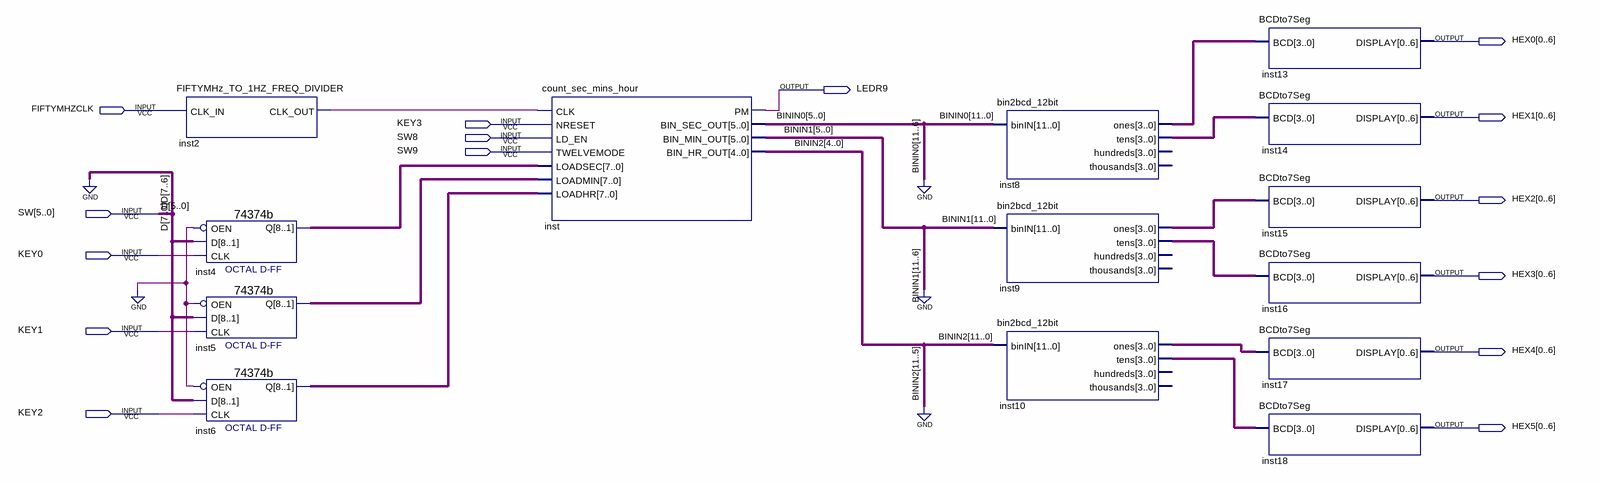
[diagram p0: schematic sheet]
// Quartus schematic lab3redo.bdf as structural Verilog: 14 symbols, 15 pins
module lab3redo (
  input  FIFTYMHZCLK,
  input  KEY3,
  input  SW8,
  input  SW9,
  input  [5:0] SW,
  input  KEY0,
  input  KEY1,
  input  KEY2,
  output [0:6] HEX0,
  output LEDR9,
  output [0:6] HEX1,
  output [0:6] HEX2,
  output [0:6] HEX3,
  output [0:6] HEX4,
  output [0:6] HEX5
);

  wire inst2_clk_out;
  wire [3:0] inst8_ones, inst8_tens, inst9_ones, inst9_tens, inst10_ones, inst10_tens;
  wire [4:0] BININ2;
  wire [5:0] BININ0, BININ1;
  wire [7:0] inst4_q, inst5_q, inst6_q;

  FIFTYMHz_TO_1HZ_FREQ_DIVIDER inst2 (.CLK_IN(FIFTYMHZCLK), .CLK_OUT(inst2_clk_out));
  \74374b  inst4 (.D({2'b00, SW}), .OEN(1'b0), .CLK(KEY0), .Q(inst4_q));
  \74374b  inst5 (.D({2'b00, SW}), .OEN(1'b0), .CLK(KEY1), .Q(inst5_q));
  \74374b  inst6 (.D({2'b00, SW}), .OEN(1'b0), .CLK(KEY2), .Q(inst6_q));
  count_sec_mins_hour inst (
    .CLK(inst2_clk_out), .NRESET(KEY3), .LD_EN(SW8), .TWELVEMODE(SW9), .LOADSEC(inst4_q), .LOADMIN(inst5_q),
    .LOADHR(inst6_q), .PM(LEDR9), .BIN_SEC_OUT(BININ0), .BIN_MIN_OUT(BININ1), .BIN_HR_OUT(BININ2));
  bin2bcd_12bit inst8 (.binIN({{6{1'b0}}, BININ0}), .ones(inst8_ones), .tens(inst8_tens));  // open: hundreds, thousands
  bin2bcd_12bit inst9 (.binIN({{6{1'b0}}, BININ1}), .ones(inst9_ones), .tens(inst9_tens));  // open: hundreds, thousands
  bin2bcd_12bit inst10 (
    .binIN({{7{1'b0}}, BININ2}), .ones(inst10_ones), .tens(inst10_tens));  // open: hundreds, thousands
  BCDto7Seg inst13 (.BCD(inst8_ones), .DISPLAY(HEX0));
  BCDto7Seg inst14 (.BCD(inst8_tens), .DISPLAY(HEX1));
  BCDto7Seg inst15 (.BCD(inst9_ones), .DISPLAY(HEX2));
  BCDto7Seg inst16 (.BCD(inst9_tens), .DISPLAY(HEX3));
  BCDto7Seg inst17 (.BCD(inst10_ones), .DISPLAY(HEX4));
  BCDto7Seg inst18 (.BCD(inst10_tens), .DISPLAY(HEX5));

  // Other names for the same wires on the sheet: D[5:0] = SW
endmodule
